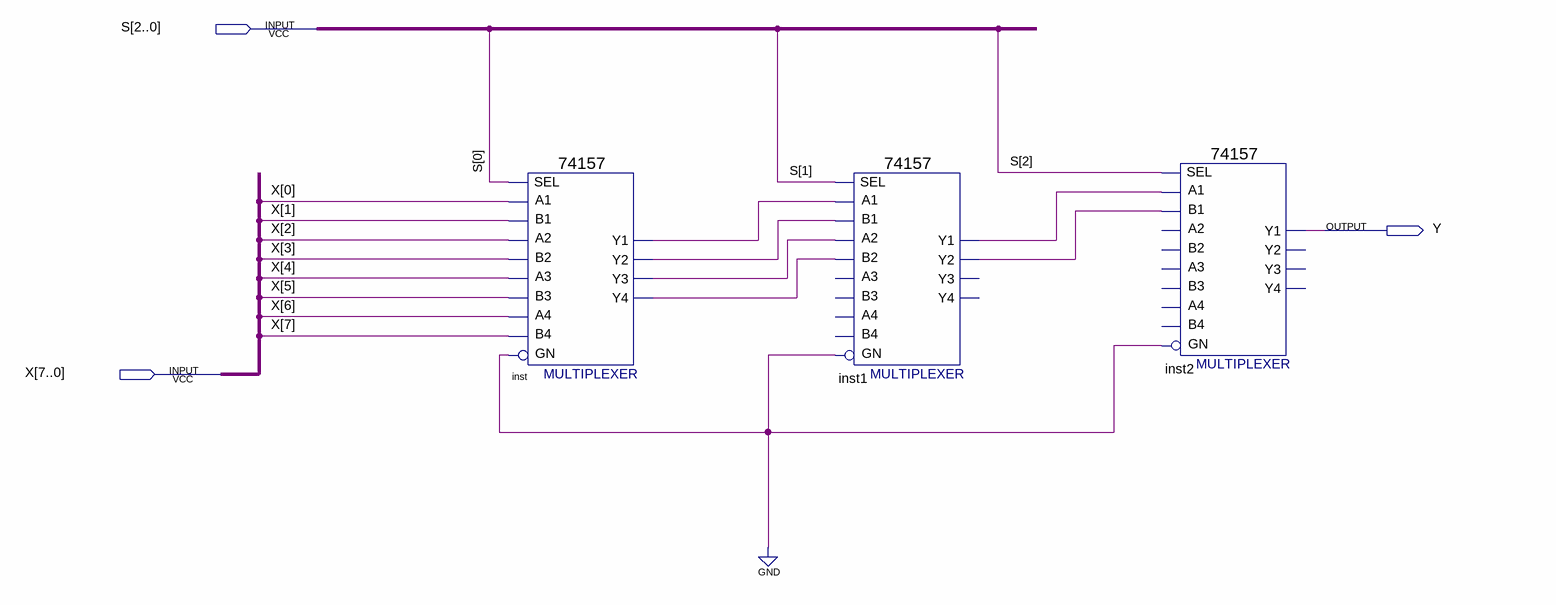
[diagram p0: schematic sheet]
// Quartus schematic teste1mux8_1.bdf as structural Verilog: 3 symbols, 3 pins
module teste1mux8_1 (
  input  [2:0] S,
  input  [7:0] X,
  output Y
);

  wire inst1_y1, inst1_y2, inst_y1, inst_y2, inst_y3, inst_y4;

  \74157  inst (
    .A1(X[0]), .B1(X[1]), .SEL(S[0]), .B2(X[3]), .A3(X[4]), .B3(X[5]), .A2(X[2]), .B4(X[7]), .GN(1'b0),
    .A4(X[6]), .Y2(inst_y2), .Y1(inst_y1), .Y4(inst_y4), .Y3(inst_y3));
  \74157  inst1 (
    .A1(inst_y1), .B1(inst_y2), .SEL(S[1]), .B2(inst_y4), .A2(inst_y3), .GN(1'b0), .Y2(inst1_y2),
    .Y1(inst1_y1));  // open: A3, B3, B4, A4, Y4, Y3
  \74157  inst2 (
    .A1(inst1_y1), .B1(inst1_y2), .SEL(S[2]), .GN(1'b0), .Y1(Y));  // open: B2, A3, B3, A2, B4, A4, Y2, Y4, Y3
endmodule
